# Altium schematic sheet 2HE2E_Tester.SchDoc
size A2; SheetNumber: 1; SheetTotal: 13
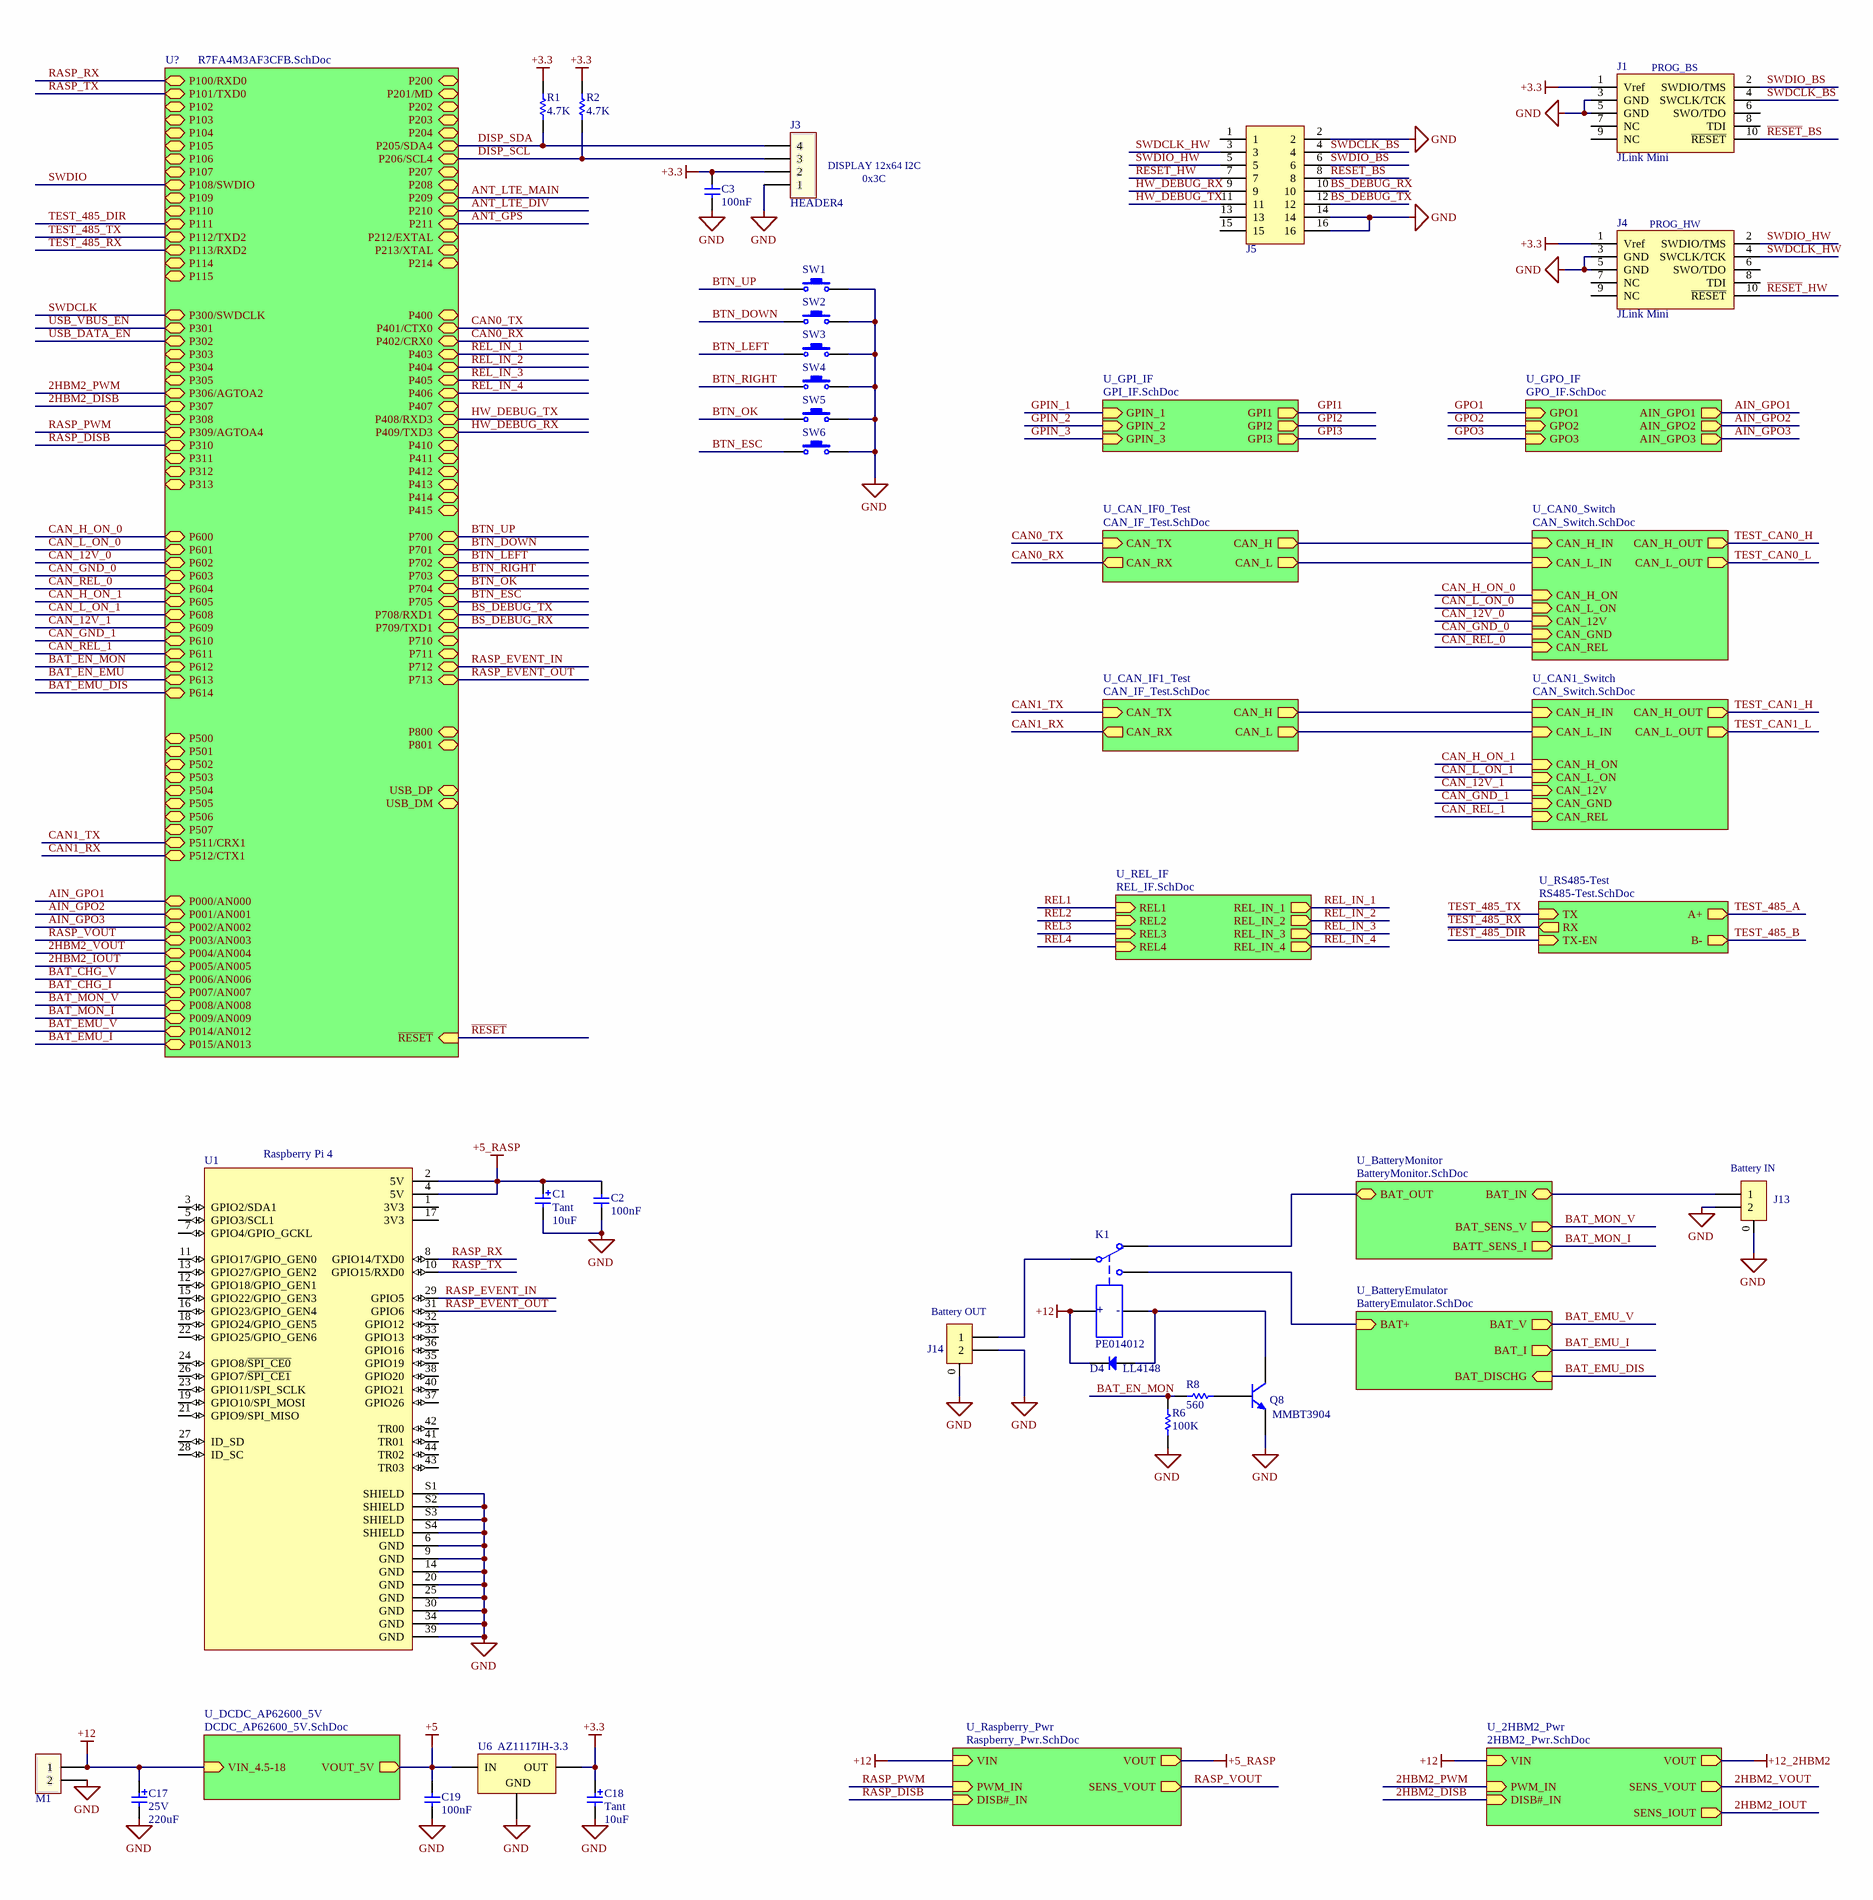
[diagram p0: 2HE2E_Tester.SchDoc, left]
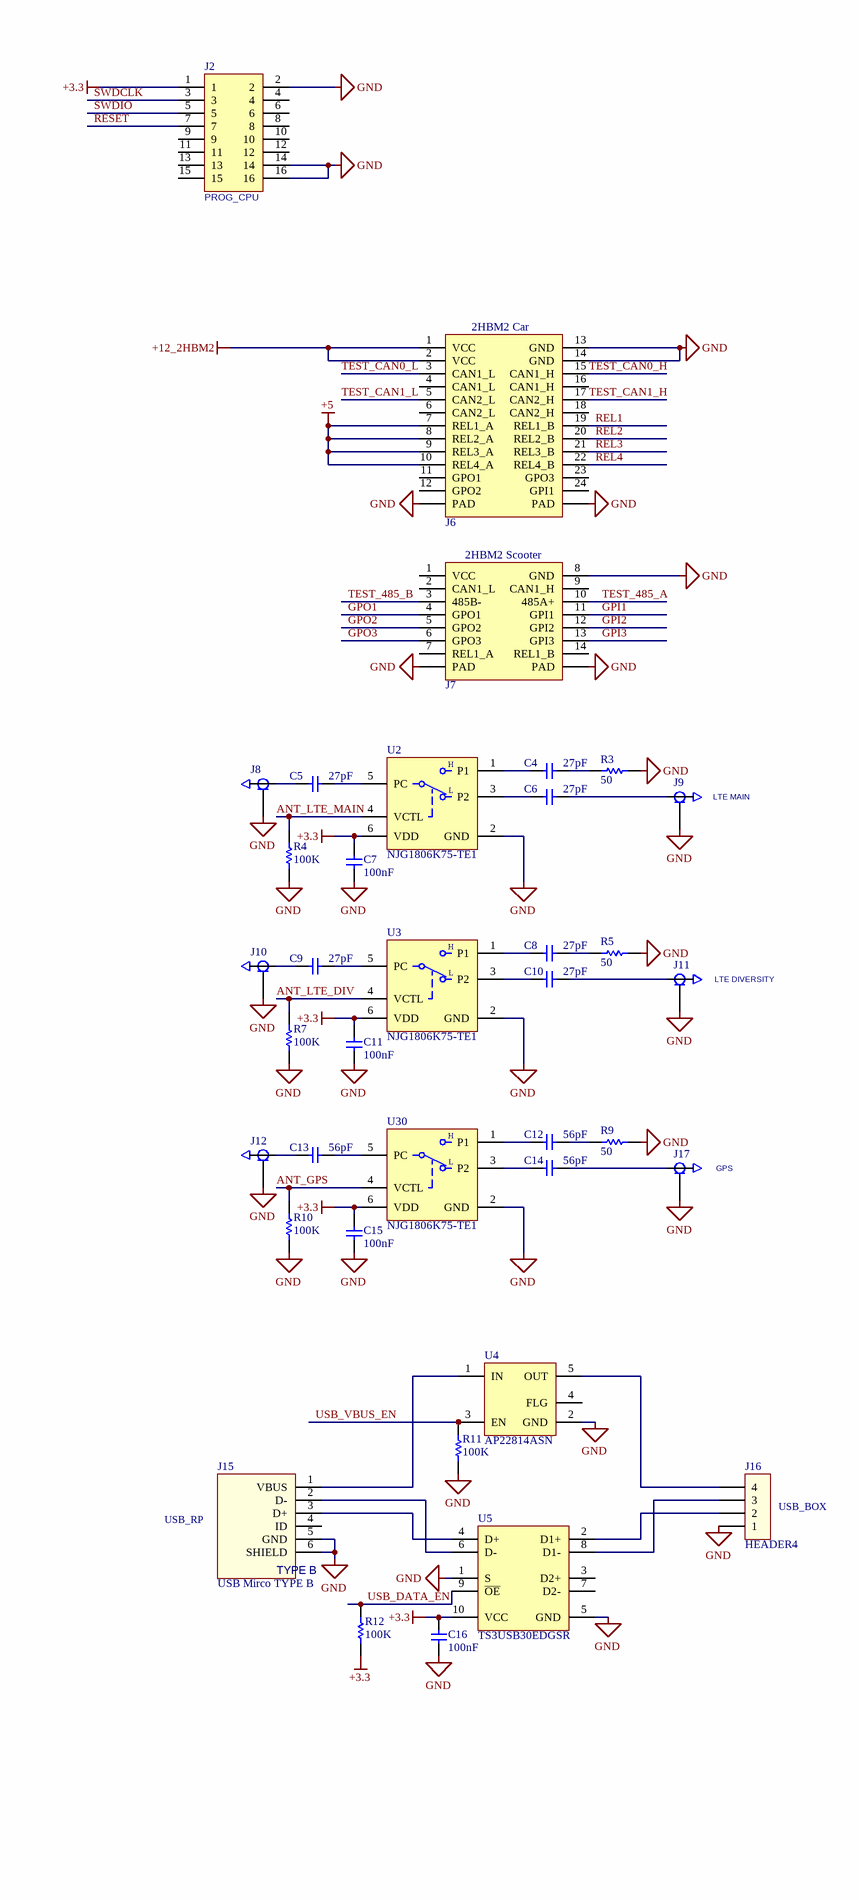
[diagram p1: 2HE2E_Tester.SchDoc, right]

## Parts
C1  Tant  value 10uF  [Cap CASE B]
C2  value 100nF  [0603M-C]  (hidden comment: Cap Ceramic)
C3  value 100nF  [0603M-C]  (hidden comment: Cap Ceramic)
C4  value 27pF  [0402M-C]  (hidden comment: Cap Ceramic)
C5  value 27pF  [0402M-C]  (hidden comment: Cap Ceramic)
C6  value 27pF  [0402M-C]  (hidden comment: Cap Ceramic)
C7  value 100nF  [0603M-C]  (hidden comment: Cap Ceramic)
C8  value 27pF  [0402M-C]  (hidden comment: Cap Ceramic)
C9  value 27pF  [0402M-C]  (hidden comment: Cap Ceramic)
C10  value 27pF  [0402M-C]  (hidden comment: Cap Ceramic)
C11  value 100nF  [0603M-C]  (hidden comment: Cap Ceramic)
C12  value 56pF  [0402M-C]  (hidden comment: Cap Ceramic)
C13  value 56pF  [0402M-C]  (hidden comment: Cap Ceramic)
C14  value 56pF  [0402M-C]  (hidden comment: Cap Ceramic)
C15  value 100nF  [0603M-C]  (hidden comment: Cap Ceramic)
C16  value 100nF  [0603M-C]  (hidden comment: Cap Ceramic)
C17  25V  value 220uF  [Cap Elet SMD 8.0 mm CASE F-H10.5mm]
C18  Tant  value 10uF  [Cap CASE B]
C19  value 100nF  [0603M-C]  (hidden comment: Cap Ceramic)
D4  LL4148  [SOD80]
J1  JLink Mini  [HEADER5x2-127]
J2  Header 8x2  [Header 8x2 WE62101621021]  (value not drawn)
J3  HEADER4  [HEADER4]
J4  JLink Mini  [HEADER5x2-127]
J5  Header 8x2  [Header 8x2 WE62101621021]  (value not drawn)
J6  2HBM2 Car  [WR-MPC3 24N 662024231722]
J7  2HBM2 Scooter  [WR-MPC3 14N 662014231722]
J8  Antenna Ipex MHFx  [COAX IPEX MHF1_20279-001E-03]  (value not drawn)
J9  Antenna Ipex MHFx  [COAX IPEX MHF1_20279-001E-03]  (value not drawn)
J10  Antenna Ipex MHFx  [COAX IPEX MHF1_20279-001E-03]  (value not drawn)
J11  Antenna Ipex MHFx  [COAX IPEX MHF1_20279-001E-03]  (value not drawn)
J12  Antenna Ipex MHFx  [COAX IPEX MHF1_20279-001E-03]  (value not drawn)
J13  Connettore 2x1+GND  [JST_S2B-PH-SM4-TB]  (value not drawn)
J14  Connettore 2x1+GND  [JST_S2B-PH-SM4-TB]  (value not drawn)
J15  USB Mirco TYPE B  [USB Micro Type B - WE629105136821]
J16  HEADER4  [HEADER4]
J17  Antenna Ipex MHFx  [COAX IPEX MHF1_20279-001E-03]  (value not drawn)
K1  PE014012  [Relay PE]
M1  Morsetto 2 Poli  [Morsetto-2 poli-5.08]  (value not drawn)
Q8  MMBT3904  [SOT23 BSR14]
R1  value 4.7K  [0603M]  (hidden comment: Resistor)
R2  value 4.7K  [0603M]  (hidden comment: Resistor)
R3  value 50  [0603M]  (hidden comment: Resistor)
R4  value 100K  [0603M]  (hidden comment: Resistor)
R5  value 50  [0603M]  (hidden comment: Resistor)
R6  value 100K  [0603M]  (hidden comment: Resistor)
R7  value 100K  [0603M]  (hidden comment: Resistor)
R8  value 560  [0603M]  (hidden comment: Resistor)
R9  value 50  [0603M]  (hidden comment: Resistor)
R10  value 100K  [0603M]  (hidden comment: Resistor)
R11  value 100K  [0603M]  (hidden comment: Resistor)
R12  value 100K  [0603M]  (hidden comment: Resistor)
SW1  Button  [Button 6x6 PHT]  (value not drawn)
SW2  Button  [Button 6x6 PHT]  (value not drawn)
SW3  Button  [Button 6x6 PHT]  (value not drawn)
SW4  Button  [Button 6x6 PHT]  (value not drawn)
SW5  Button  [Button 6x6 PHT]  (value not drawn)
SW6  Button  [Button 6x6 PHT]  (value not drawn)
U1  Raspberry Pi 4  [MODULE RASPBERRY PI 4B]
U2  NJG1806K75-TE1  [NJG1806K75TE1]
U3  NJG1806K75-TE1  [NJG1806K75TE1]
U4  AP22814ASN  [U-DFN2020-127P600-6N]
U5  TS3USB30EDGSR  [TSSOP50P491-10N]
U6  AZ1117IH-3.3  [SOT223-SOT230P700X180-4N]
U30  NJG1806K75-TE1  [NJG1806K75TE1]

## Sub-sheets
U? = R7FA4M3AF3CFB.SchDoc: P400 (bidir), P403 (bidir), P404 (bidir), P405 (bidir), P406 (bidir), P700 (bidir), P701 (bidir), P702 (bidir), P703 (bidir), P704 (bidir), P705 (bidir), P213/XTAL (bidir), P212/EXTAL (bidir), P713 (bidir), P712 (bidir), P711 (bidir), P415 (bidir), P414 (bidir), P413 (bidir), P412 (bidir), P411 (bidir), P410 (bidir), P407 (bidir), USB_DM (bidir), USB_DP (bidir), P207 (bidir), P204 (bidir), P203 (bidir), P202 (bidir), P313 (bidir), P214 (bidir), P211 (bidir), P210 (bidir), P209 (bidir), P208 (bidir), P201/MD (bidir), P200 (bidir), P312 (bidir), P311 (bidir), P310 (bidir), P308 (bidir), P307 (bidir), P305 (bidir), P304 (bidir), P303 (bidir), P302 (bidir), P301 (bidir), P300/SWDCLK (bidir), P108/SWDIO (bidir), P109 (bidir), P110 (bidir), P111 (bidir), P114 (bidir), P115 (bidir), P608 (bidir), P609 (bidir), P610 (bidir), P611 (bidir), P612 (bidir), P613 (bidir), P614 (bidir), P605 (bidir), P604 (bidir), P603 (bidir), P602 (bidir), P601 (bidir), P600 (bidir), P107 (bidir), P106 (bidir), P105 (bidir), P104 (bidir), P103 (bidir), P102 (bidir), P800 (bidir), P801 (bidir), P500 (bidir), P501 (bidir), P502 (bidir), P503 (bidir), P504 (bidir), P505 (bidir), P506 (bidir), P507 (bidir), ~{RESET} (in), P512/CTX1 (bidir), P511/CRX1 (bidir), P401/CTX0 (bidir), P402/CRX0 (bidir), P002/AN002 (bidir), P001/AN001 (bidir), P000/AN000 (bidir), P101/TXD0 (bidir), P100/RXD0 (bidir), P112/TXD2 (bidir), P113/RXD2 (bidir), P710 (bidir), P709/TXD1 (bidir), P708/RXD1 (bidir), P409/TXD3 (bidir), P408/RXD3 (bidir), P306/AGTOA2 (bidir), P309/AGTOA4 (bidir), P005/AN005 (bidir), P004/AN004 (bidir), P003/AN003 (bidir), P007/AN007 (bidir), P006/AN006 (bidir), P015/AN013 (bidir), P014/AN012 (bidir), P009/AN009 (bidir), P008/AN008 (bidir), P206/SCL4 (bidir), P205/SDA4 (bidir)
U_2HBM2_Pwr = 2HBM2_Pwr.SchDoc: SENS_VOUT (out), SENS_IOUT (out), PWM_IN (in), DISB#_IN (in), VOUT (out), VIN (in)
U_BatteryEmulator = BatteryEmulator.SchDoc: BAT+ (in), BAT_DISCHG (in), BAT_V (out), BAT_I (out)
U_BatteryMonitor = BatteryMonitor.SchDoc: BAT_SENS_V (out), BATT_SENS_I (out), BAT_OUT (bidir), BAT_IN (bidir)
U_CAN0_Switch = CAN_Switch.SchDoc: CAN_H_IN (in), CAN_L_IN (in), CAN_REL (in), CAN_H_OUT (out), CAN_L_OUT (out), CAN_12V (in), CAN_GND (in), CAN_H_ON (in), CAN_L_ON (in)
U_CAN1_Switch = CAN_Switch.SchDoc: CAN_H_IN (in), CAN_L_IN (in), CAN_REL (in), CAN_H_OUT (out), CAN_L_OUT (out), CAN_12V (in), CAN_GND (in), CAN_H_ON (in), CAN_L_ON (in)
U_CAN_IF0_Test = CAN_IF_Test.SchDoc: CAN_TX (in), CAN_RX (out), CAN_L (out), CAN_H (out)
U_CAN_IF1_Test = CAN_IF_Test.SchDoc: CAN_TX (in), CAN_RX (out), CAN_L (out), CAN_H (out)
U_DCDC_AP62600_5V = DCDC_AP62600_5V.SchDoc: VIN_4.5-18 (in), VOUT_5V (out)
U_GPI_IF = GPI_IF.SchDoc: GPI1 (out), GPIN_1 (in), GPI2 (out), GPI3 (out), GPIN_2 (in), GPIN_3 (in)
U_GPO_IF = GPO_IF.SchDoc: GPO1 (in), GPO2 (in), GPO3 (in), AIN_GPO1 (out), AIN_GPO2 (out), AIN_GPO3 (out)
U_Raspberry_Pwr = Raspberry_Pwr.SchDoc: SENS_VOUT (out), PWM_IN (in), DISB#_IN (in), VOUT (out), VIN (in)
U_REL_IF = REL_IF.SchDoc: REL1 (in), REL_IN_1 (out), REL2 (in), REL_IN_2 (out), REL3 (in), REL_IN_3 (out), REL4 (in), REL_IN_4 (out)
U_RS485-Test = RS485-Test.SchDoc: RX (out), TX-EN (in), TX (in), A+ (out), B- (out)

## Nets
+3.3: C3.1 C7.1 C11.1 C15.1 C16.1 C18.1 J1.1(Vref) J2.1 J3.2 J4.1(Vref) R1.2 R2.2 R12.1 U2.6(VDD) U3.6(VDD) U5.10(VCC) U6.2(OUT) U30.6(VDD)
+5: C19.1 J6.7(REL1_A) J6.8(REL2_A) J6.9(REL3_A) J6.10(REL4_A) U6.3(IN) ; sheet U_DCDC_AP62600_5V/VOUT_5V
+5_RASP: C1.1 C2.1 U1.2(5V) U1.4(5V) ; sheet U_Raspberry_Pwr/VOUT
+12: C17.1 D4.2(K) K1.1 M1.1 ; sheet U_DCDC_AP62600_5V/VIN_4.5-18, sheet U_Raspberry_Pwr/VIN, sheet U_2HBM2_Pwr/VIN
+12_2HBM2: J6.1(VCC) J6.2(VCC) ; sheet U_2HBM2_Pwr/VOUT
GND: C1.2 C2.2 C3.2 C7.2 C11.2 C15.2 C16.2 C17.2 C18.2 C19.2 J1.3(GND) J1.5(GND) J2.2 J2.14 J2.16 J3.1 J4.3(GND) J4.5(GND) J5.2 J5.14 J5.16 J6.13(GND) J6.14(GND) J6.MP1(PAD) J6.MP2(PAD) J7.8(GND) J7.MP1(PAD) J7.MP2(PAD) J8.2(GND) J9.2(GND) J10.2(GND) J11.2(GND) J12.2(GND) J13.0 J13.2 J14.0 J14.2 J15.5(GND) J15.6(SHIELD) J16.1 J17.2(GND) M1.2 Q8.3(E) R3.1 R4.1 R5.1 R6.2 R7.1 R9.1 R10.1 R11.1 SW1.2 SW2.2 SW3.2 SW4.2 SW5.2 SW6.2 U1.6(GND) U1.9(GND) U1.14(GND) U1.20(GND) U1.25(GND) U1.30(GND) U1.34(GND) U1.39(GND) U1.S1(SHIELD) U1.S2(SHIELD) U1.S3(SHIELD) U1.S4(SHIELD) U2.2(GND) U3.2(GND) U4.2(GND) U5.1(S) U5.5(GND) U6.1(GND) U30.2(GND)
2HBM2_DISB: sheet U?/P307, sheet U_2HBM2_Pwr/DISB#_IN
2HBM2_IOUT: sheet U?/P005/AN005, sheet U_2HBM2_Pwr/SENS_IOUT
2HBM2_PWM: sheet U?/P306/AGTOA2, sheet U_2HBM2_Pwr/PWM_IN
2HBM2_VOUT: sheet U?/P004/AN004, sheet U_2HBM2_Pwr/SENS_VOUT
AIN_GPO1: sheet U_GPO_IF/AIN_GPO1, sheet U?/P000/AN000
AIN_GPO2: sheet U_GPO_IF/AIN_GPO2, sheet U?/P001/AN001
AIN_GPO3: sheet U_GPO_IF/AIN_GPO3, sheet U?/P002/AN002
ANT_GPS: R10.2 U30.4(VCTL) ; sheet U?/P211
ANT_LTE_DIV: R7.2 U3.4(VCTL) ; sheet U?/P210
ANT_LTE_MAIN: R4.2 U2.4(VCTL) ; sheet U?/P209
BAT_CHG_I: sheet U?/P007/AN007
BAT_CHG_V: sheet U?/P006/AN006
BAT_EMU_DIS: sheet U?/P614, sheet U_BatteryEmulator/BAT_DISCHG
BAT_EMU_I: sheet U?/P015/AN013, sheet U_BatteryEmulator/BAT_I
BAT_EMU_V: sheet U?/P014/AN012, sheet U_BatteryEmulator/BAT_V
BAT_EN_EMU: sheet U?/P613
BAT_EN_MON: R6.1 R8.1 ; sheet U?/P612
BAT_MON_I: sheet U?/P009/AN009, sheet U_BatteryMonitor/BATT_SENS_I
BAT_MON_V: sheet U?/P008/AN008, sheet U_BatteryMonitor/BAT_SENS_V
BS_DEBUG_RX: J5.10 ; sheet U?/P709/TXD1
BS_DEBUG_TX: J5.12 ; sheet U?/P708/RXD1
BTN_DOWN: SW2.1 ; sheet U?/P701
BTN_ESC: SW6.1 ; sheet U?/P705
BTN_LEFT: SW3.1 ; sheet U?/P702
BTN_OK: SW5.1 ; sheet U?/P704
BTN_RIGHT: SW4.1 ; sheet U?/P703
BTN_UP: SW1.1 ; sheet U?/P700
CAN0_RX: sheet U_CAN_IF0_Test/CAN_RX, sheet U?/P402/CRX0
CAN0_TX: sheet U_CAN_IF0_Test/CAN_TX, sheet U?/P401/CTX0
CAN1_RX: sheet U_CAN_IF1_Test/CAN_RX, sheet U?/P512/CTX1
CAN1_TX: sheet U_CAN_IF1_Test/CAN_TX, sheet U?/P511/CRX1
CAN_12V_0: sheet U_CAN0_Switch/CAN_12V, sheet U?/P602
CAN_12V_1: sheet U_CAN1_Switch/CAN_12V, sheet U?/P609
CAN_GND_0: sheet U_CAN0_Switch/CAN_GND, sheet U?/P603
CAN_GND_1: sheet U_CAN1_Switch/CAN_GND, sheet U?/P610
CAN_H_ON_0: sheet U_CAN0_Switch/CAN_H_ON, sheet U?/P600
CAN_H_ON_1: sheet U_CAN1_Switch/CAN_H_ON, sheet U?/P605
CAN_L_ON_0: sheet U_CAN0_Switch/CAN_L_ON, sheet U?/P601
CAN_L_ON_1: sheet U_CAN1_Switch/CAN_L_ON, sheet U?/P608
CAN_REL_0: sheet U_CAN0_Switch/CAN_REL, sheet U?/P604
CAN_REL_1: sheet U_CAN1_Switch/CAN_REL, sheet U?/P611
DISP_SCL: J3.3 R2.1 ; sheet U?/P206/SCL4
DISP_SDA: J3.4 R1.1 ; sheet U?/P205/SDA4
GPI1: J7.11(GPI1) ; sheet U_GPI_IF/GPI1
GPI2: J7.12(GPI2) ; sheet U_GPI_IF/GPI2
GPI3: J7.13(GPI3) ; sheet U_GPI_IF/GPI3
GPIN_1: sheet U_GPI_IF/GPIN_1
GPIN_2: sheet U_GPI_IF/GPIN_2
GPIN_3: sheet U_GPI_IF/GPIN_3
GPO1: J7.4(GPO1) ; sheet U_GPO_IF/GPO1
GPO2: J7.5(GPO2) ; sheet U_GPO_IF/GPO2
GPO3: J7.6(GPO3) ; sheet U_GPO_IF/GPO3
HW_DEBUG_RX: J5.9 ; sheet U?/P409/TXD3
HW_DEBUG_TX: J5.11 ; sheet U?/P408/RXD3
~{RESET}: J2.7 ; sheet U?/~{RESET}
~{RESET}_BS: J1.10(~{RESET}) J5.8
~{RESET}_HW: J4.10(~{RESET}) J5.7
RASP_DISB: sheet U?/P310, sheet U_Raspberry_Pwr/DISB#_IN
RASP_EVENT_IN: U1.29(GPIO5) ; sheet U?/P712
RASP_EVENT_OUT: U1.31(GPIO6) ; sheet U?/P713
RASP_PWM: sheet U?/P309/AGTOA4, sheet U_Raspberry_Pwr/PWM_IN
RASP_RX: U1.8(GPIO14/TXD0) ; sheet U?/P100/RXD0
RASP_TX: U1.10(GPIO15/RXD0) ; sheet U?/P101/TXD0
RASP_VOUT: sheet U?/P003/AN003, sheet U_Raspberry_Pwr/SENS_VOUT
REL1: J6.19(REL1_B) ; sheet U_REL_IF/REL1
REL2: J6.20(REL2_B) ; sheet U_REL_IF/REL2
REL3: J6.21(REL3_B) ; sheet U_REL_IF/REL3
REL4: J6.22(REL4_B) ; sheet U_REL_IF/REL4
REL_IN_1: sheet U_REL_IF/REL_IN_1, sheet U?/P403
REL_IN_2: sheet U_REL_IF/REL_IN_2, sheet U?/P404
REL_IN_3: sheet U_REL_IF/REL_IN_3, sheet U?/P405
REL_IN_4: sheet U_REL_IF/REL_IN_4, sheet U?/P406
SWDCLK: J2.3 ; sheet U?/P300/SWDCLK
SWDCLK_BS: J1.4(SWCLK/TCK) J5.4
SWDCLK_HW: J4.4(SWCLK/TCK) J5.3
SWDIO: J2.5 ; sheet U?/P108/SWDIO
SWDIO_BS: J1.2(SWDIO/TMS) J5.6
SWDIO_HW: J4.2(SWDIO/TMS) J5.5
TEST_485_A: J7.10(485A+) ; sheet U_RS485-Test/A+
TEST_485_B: J7.3(485B-) ; sheet U_RS485-Test/B-
TEST_485_DIR: sheet U_RS485-Test/TX-EN, sheet U?/P111
TEST_485_RX: sheet U_RS485-Test/RX, sheet U?/P113/RXD2
TEST_485_TX: sheet U_RS485-Test/TX, sheet U?/P112/TXD2
TEST_CAN0_H: J6.15(CAN1_H) ; sheet U_CAN0_Switch/CAN_H_OUT
TEST_CAN0_L: J6.3(CAN1_L) ; sheet U_CAN0_Switch/CAN_L_OUT
TEST_CAN1_H: J6.17(CAN2_H) ; sheet U_CAN1_Switch/CAN_H_OUT
TEST_CAN1_L: J6.5(CAN2_L) ; sheet U_CAN1_Switch/CAN_L_OUT
USB_DATA_EN: R12.2 U5.9(~{OE}) ; sheet U?/P302
USB_VBUS_EN: R11.2 U4.3(EN) ; sheet U?/P301
NetC4_1: C4.1 U2.1(P1)
NetC4_2: C4.2 R3.2
NetC5_1: C5.1 J8.1(SIGNAL)
NetC5_2: C5.2 U2.5(PC)
NetC6_1: C6.1 U2.3(P2)
NetC6_2: C6.2 J9.1(SIGNAL)
NetC8_1: C8.1 U3.1(P1)
NetC8_2: C8.2 R5.2
NetC9_1: C9.1 J10.1(SIGNAL)
NetC9_2: C9.2 U3.5(PC)
NetC10_1: C10.1 U3.3(P2)
NetC10_2: C10.2 J11.1(SIGNAL)
NetC12_1: C12.1 U30.1(P1)
NetC12_2: C12.2 R9.2
NetC13_1: C13.1 J12.1(SIGNAL)
NetC13_2: C13.2 U30.5(PC)
NetC14_1: C14.1 U30.3(P2)
NetC14_2: C14.2 J17.1(SIGNAL)
NetD4_1: D4.1(A) K1.6 Q8.1(C)
NetJ13_1: J13.1 ; sheet U_BatteryMonitor/BAT_IN
NetJ14_1: J14.1 K1.7
NetJ15_1: J15.1(VBUS) U4.1(IN)
NetJ15_2: J15.2(D-) U5.6(D-)
NetJ15_3: J15.3(D+) U5.4(D+)
NetJ16_2: J16.2 U5.2(D1+)
NetJ16_3: J16.3 U5.8(D1-)
NetJ16_4: J16.4 U4.5(OUT)
NetK1_10: K1.10 ; sheet U_BatteryMonitor/BAT_OUT
NetK1_12: K1.12 ; sheet U_BatteryEmulator/BAT+
NetQ8_2: Q8.2(B) R8.2
(unnamed): sheet U_CAN_IF0_Test/CAN_L, sheet U_CAN0_Switch/CAN_L_IN
(unnamed): sheet U_CAN_IF0_Test/CAN_H, sheet U_CAN0_Switch/CAN_H_IN
(unnamed): sheet U_CAN_IF1_Test/CAN_L, sheet U_CAN1_Switch/CAN_L_IN
(unnamed): sheet U_CAN_IF1_Test/CAN_H, sheet U_CAN1_Switch/CAN_H_IN

Not connected (* = marked no-connect by the designer): J1 6(SWO/TDO) 7(NC) 8(TDI) 9(NC); J2 4 6 8 9 10 11 12 13 15; J4 6(SWO/TDO) 7(NC) 8(TDI) 9(NC); J5 1 13 15; J6 4(CAN1_L) 6(CAN2_L) 11(GPO1) 12(GPO2) 16(CAN1_H) 18(CAN2_H) 23(GPO3) 24(GPI1); J7 1(VCC) 2(CAN1_L) 7(REL1_A) 9(CAN1_H) 14(REL1_B); J15 4(ID); U1 1(3V3) 3(GPIO2/SDA1) 5(GPIO3/SCL1) 7(GPIO4/GPIO_GCKL) 11(GPIO17/GPIO_GEN0) 12(GPIO18/GPIO_GEN1) 13(GPIO27/GPIO_GEN2) 15(GPIO22/GPIO_GEN3) 16(GPIO23/GPIO_GEN4) 17(3V3) 18(GPIO24/GPIO_GEN5) 19(GPIO10/SPI_MOSI) 21(GPIO9/SPI_MISO) 22(GPIO25/GPIO_GEN6) 23(GPIO11/SPI_SCLK) 24(GPIO8/~{SPI_CE0}) 26(GPIO7/~{SPI_CE1}) 27(ID_SD) 28(ID_SC) 32(GPIO12) 33(GPIO13) 35(GPIO19) 36(GPIO16) 37(GPIO26) 38(GPIO20) 40(GPIO21) 41(TR01) 42(TR00) 43(TR03) 44(TR02); U4 4(FLG); U5 3(D2+) 7(D2-)

## Notes on the sheet
- (near J1) PROG_BS
- (near J3) DISPLAY 12x64 I2C
- 0x3C
- (near J2) PROG_CPU
- (near J4) PROG_HW
- (near J9) LTE MAIN
- (near J11) LTE DIVERSITY
- (near J13) Battery IN
- (near J17) GPS
- (near J14) Battery OUT
- USB_RP
- (near J16) USB_BOX
- Title
- Size:
- Date:
- A4
- Number:
- Time:
- Revision:
- Sheet
- of
- File:
- (in symbol NJG1806K75-TE1) H; L
- (in symbol Relay SPDT) +; -
- (in symbol USB Micro_TYPEB) TYPE B

## Library data of the parts
C1 C18 = Cap Tantalio: Capacitor tantalio SMD
C2-C16 C19 = Cap Ceramic: Ceramic Capacitor
C17 = Cap Elettrolitico: Condensatore elettrolitico
D4 = Diodo: Small Signal Diode
J1 J4 = Connettore JLink Mini: Connettore JTAG/SWD 5x2 P1.27 JLink Mini
J2 J5 = Header 8x2: WE 62101621021
J3 J16 = HEADER4: Header 4 pin
J6 = Connettore 2Hire 2HBM2_Car: Connettore 12x2 WE 662024231722
J7 = Connettore 2Hire 2HBM2_Scooter: Connettore 7x2 WE 662014231722
J8-J12 J17 = Connettore Ipex MHFx: 1 POS Vertical SMD Small form factor with big performance through 6 GHz connector, RF, micro-coaxial MHF x Receptacle; MP: 20449-001E-03; MF: I-PEX; SnapEDA_Link: https://www.snapeda.com/parts/20449-001E-03/I-PEX/view-part/?ref=snap; Package: None; Check_prices: https://www.snapeda.com/parts/20449-001E-03/I-PEX/view-part/?ref=eda; Purchase-URL: https://pricing.snapeda.com/search/part/20449-001E-03/?ref=eda; Price: None; Value: *; Availability: In Stock
J13 J14 = Connettore 2x1+GND: Connettore 2x1
J15 = USB Micro_TYPEB: Connettore MicroUSB Client (TYPE B)
K1 = Relay SPDT: Relay DPDT Coil 12V PE014012
M1 = Morsetto 2 Poli: Morsetto 2 poli PCB
Q8 = Transistor NPN: NPN Bipolar Transistor
SW1-SW6 = Button: Button SPST
U1 = Raspberry Pi 4: BCM2711 Raspberry Pi 4 Model B 4GB - ARM Cortex-A72 MPU Embedded Evaluation Board; MP: RASPBERRY PI 4B/4GB; Price: None; MF: Raspberry Pi; Check_prices: https://www.snapeda.com/parts/RASPBERRY%20PI%204B/4GB/Raspberry+Pi/view-part/?ref=eda; Value: *; Purchase-URL: https://pricing.snapeda.com/search/part/RASPBERRY PI 4B/4GB/?ref=eda; Availability: In Stock; SnapEDA_Link: https://www.snapeda.com/parts/RASPBERRY%20PI%204B/4GB/Raspberry+Pi/view-part/?ref=snap; Package: None
U2 U3 U30 = NJG1806K75-TE1: RF Switch ICs 1bit SPDT Switch IC GaAs MMIC
U4 = AP22814ASN: Single  channel current-limited  integrated high-side power switch - Active High - DFN
U5 = TS3USB30EDGSR: High-Speed USB 2.0 (480-Mbps) 1:2 Multiplexer/Demultiplexer Switch With Single Enable
U6 = AZ1117IH: Regolatore LDO fixed 3.3V 1A